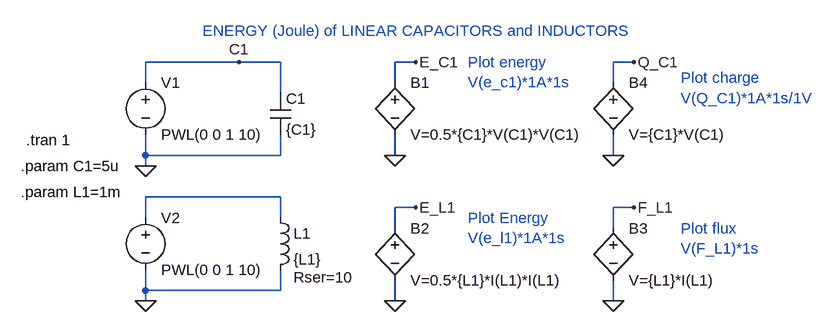
[diagram p0: schematic plot_energy_charge_flux1.asc]
plot_energy_charge_flux1.asc, the LTspice schematic file:
Version 4
SHEET 1 1152 680
WIRE 240 160 96 160
WIRE 304 160 240 160
WIRE 512 160 480 160
WIRE 848 160 816 160
WIRE 96 192 96 160
WIRE 480 192 480 160
WIRE 816 192 816 160
WIRE 304 208 304 160
WIRE 96 304 96 272
WIRE 304 304 304 272
WIRE 304 304 96 304
WIRE 480 304 480 272
WIRE 816 304 816 272
WIRE 96 320 96 304
WIRE 304 368 96 368
WIRE 512 384 480 384
WIRE 848 384 816 384
WIRE 96 400 96 368
WIRE 304 400 304 368
WIRE 480 416 480 384
WIRE 816 416 816 384
WIRE 96 512 96 480
WIRE 304 512 304 480
WIRE 304 512 96 512
WIRE 96 528 96 512
WIRE 480 528 480 496
WIRE 816 528 816 496
FLAG 96 320 0
FLAG 240 160 C1
FLAG 480 304 0
FLAG 512 160 E_C1
FLAG 96 528 0
FLAG 480 528 0
FLAG 512 384 E_L1
FLAG 816 528 0
FLAG 848 384 F_L1
FLAG 816 304 0
FLAG 848 160 Q_C1
SYMBOL cap 288 208 R0
SYMATTR InstName C1
SYMATTR Value {C1}
SYMBOL voltage 96 176 R0
WINDOW 123 0 0 Left 0
WINDOW 39 0 0 Left 0
SYMATTR InstName V1
SYMATTR Value PWL(0 0 1 10)
SYMBOL bv 480 176 R0
SYMATTR InstName B1
SYMATTR Value V=0.5*{C1}*V(C1)*V(C1)
SYMBOL voltage 96 384 R0
WINDOW 123 0 0 Left 0
WINDOW 39 0 0 Left 0
SYMATTR InstName V2
SYMATTR Value PWL(0 0 1 10)
SYMBOL ind 288 384 R0
WINDOW 39 36 108 Left 0
SYMATTR SpiceLine Rser=10
SYMATTR InstName L1
SYMATTR Value {L1}
SYMBOL bv 480 400 R0
SYMATTR InstName B2
SYMATTR Value V=0.5*{L1}*I(L1)*I(L1)
SYMBOL bv 816 400 R0
SYMATTR InstName B3
SYMATTR Value V={L1}*I(L1)
SYMBOL bv 816 176 R0
SYMATTR InstName B4
SYMATTR Value V={C1}*V(C1)
TEXT -88 280 Left 0 !.tran 1
TEXT -96 320 Left 0 !.param C1=5u
TEXT -96 360 Left 0 !.param L1=1m
TEXT 592 160 Left 0 ;Plot energy\nV(e_c1)*1A*1s
TEXT 592 400 Left 0 ;Plot Energy\nV(e_l1)*1A*1s
TEXT 184 112 Left 0 ;ENERGY (Joule) of LINEAR CAPACITORS and INDUCTORS
TEXT 920 184 Left 0 ;Plot charge\nV(Q_C1)*1A*1s/1V
TEXT 920 416 Left 0 ;Plot flux\nV(F_L1)*1s

The netlist it stands for:
* plot_energy_charge_flux1.asc
C1 C1 0 {C1}
V1 C1 0 PWL(0 0 1 10)
B1 E_C1 0 V=0.5*{C1}*V(C1)*V(C1)
V2 N001 0 PWL(0 0 1 10)
L1 N001 0 {L1} Rser=10
B2 E_L1 0 V=0.5*{L1}*I(L1)*I(L1)
B3 F_L1 0 V={L1}*I(L1)
B4 Q_C1 0 V={C1}*V(C1)
.tran 1
.param C1=5u
.param L1=1m
* Plot energy
* V(e_c1)*1A*1s
* Plot Energy
* V(e_l1)*1A*1s
* ENERGY (Joule) of LINEAR CAPACITORS and INDUCTORS
* Plot charge
* V(Q_C1)*1A*1s/1V
* Plot flux
* V(F_L1)*1s
.backanno
.end